# Altium schematic sheet 02_Filtr2.SchDoc
size A4; Organization: OLTEST; Revision: 01; SheetNumber: 2; SheetTotal: 2; Название листа: Название листа; Разработчик: Бондарчук С.; Прибор: R100; АМАК.000000.000 Э3: R100.220.020.000 Э3; Дата: 27.10.2018; Формат: A4; Rule: PcbType=ProtelPcb
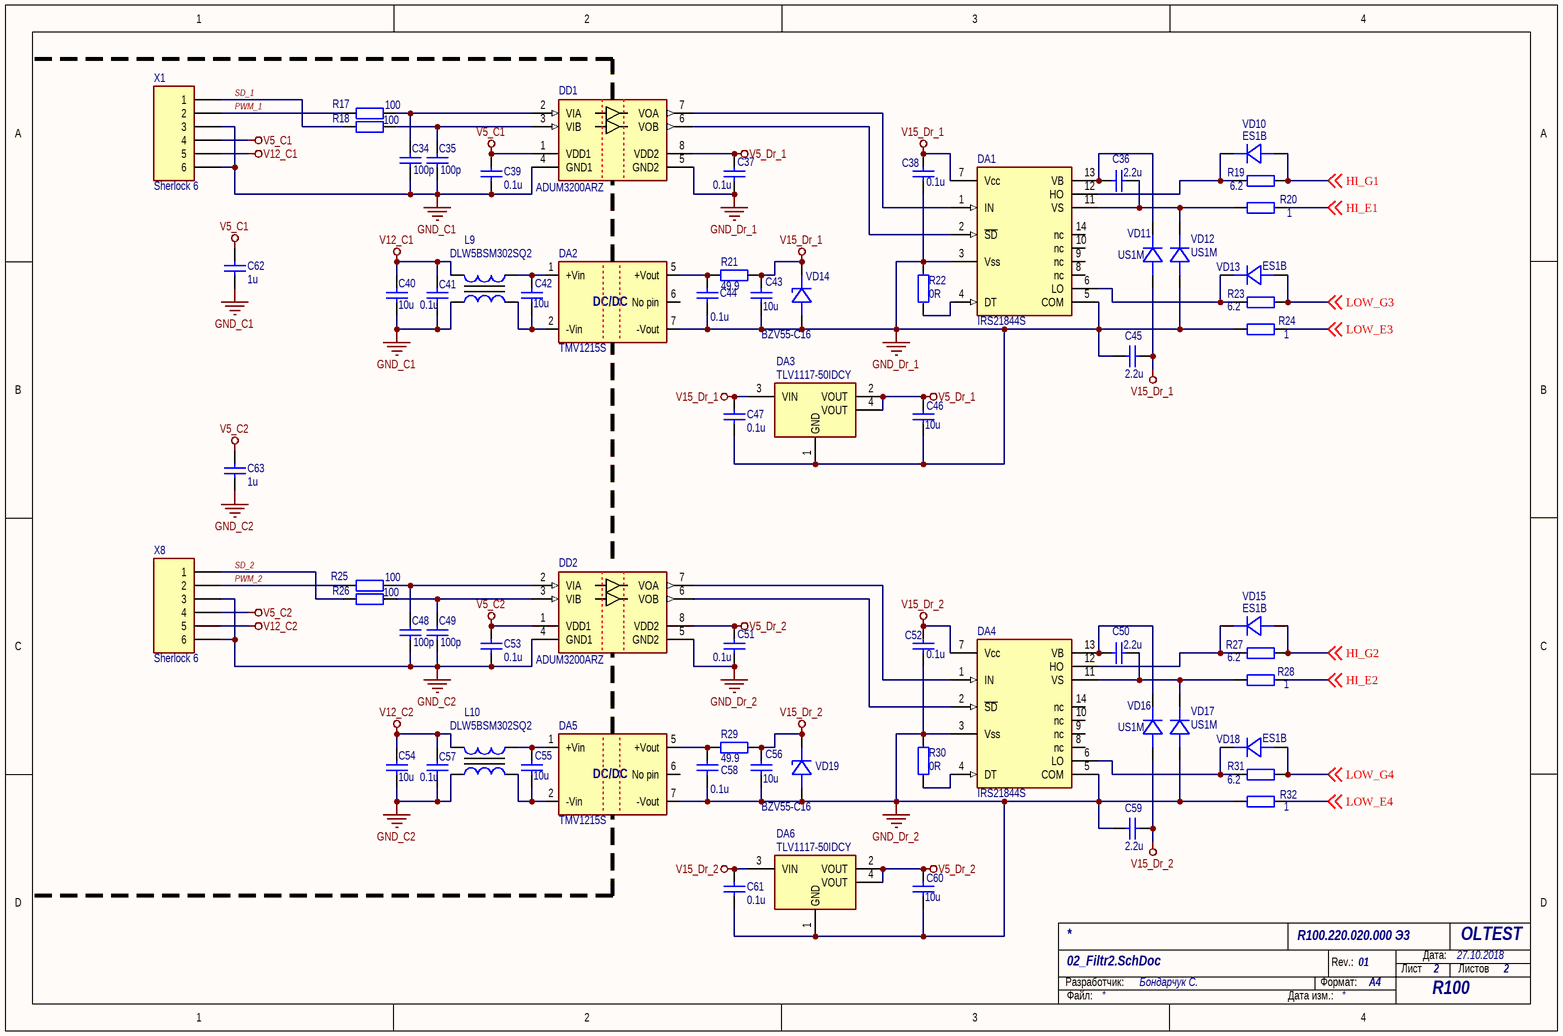
[diagram p0: 02_Filtr2.SchDoc]

## Parts
C34  100p  [SMD_C_0603]
C35  100p  [SMD_C_0603]
C36  2.2u  [SMD_C_1210]
C37  0.1u  [SMD_C_0603]
C38  0.1u  [SMD_C_0603]
C39  0.1u  [SMD_C_0603]
C40  10u  [SMD_C_1206]
C41  0.1u  [SMD_C_0603]
C42  10u  [SMD_C_1206]
C43  10u  [SMD_C_1206]
C44  0.1u  [SMD_C_0603]
C45  2.2u  [SMD_C_1210]
C46  10u  [SMD_C_1206]
C47  0.1u  [SMD_C_0603]
C48  100p  [SMD_C_0603]
C49  100p  [SMD_C_0603]
C50  2.2u  [SMD_C_1210]
C51  0.1u  [SMD_C_0603]
C52  0.1u  [SMD_C_0603]
C53  0.1u  [SMD_C_0603]
C54  10u  [SMD_C_1206]
C55  10u  [SMD_C_1206]
C56  10u  [SMD_C_1206]
C57  0.1u  [SMD_C_0603]
C58  0.1u  [SMD_C_0603]
C59  2.2u  [SMD_C_1210]
C60  10u  [SMD_C_1206]
C61  0.1u  [SMD_C_0603]
C62  1u  [SMD_C_0603]
C63  1u  [SMD_C_0603]
DA1  IRS21844S  [SOIC-14(127P600X175)]
DA2  TMV1215S  [SIP7]
DA3  TLV1117-50IDCY  [SOT-223_M]
DA4  IRS21844S  [SOIC-14(127P600X175)]
DA5  TMV1215S  [SIP7]
DA6  TLV1117-50IDCY  [SOT-223_M]
DD1  ADUM3200ARZ  [SOIC-8]
DD2  ADUM3200ARZ  [SOIC-8]
L9  DLW5BSM302SQ2  [DLW5BS(AH)]
L10  DLW5BSM302SQ2  [DLW5BS(AH)]
R17  100  [SMD_R_0603]
R18  100  [SMD_R_0603]
R19  6.2  [SMD_R_1206]
R20  1  [SMD_R_1206]
R21  49.9  [SMD_R_0805]
R22  0R  [SMD_R_0603]
R23  6.2  [SMD_R_1206]
R24  1  [SMD_R_1206]
R25  100  [SMD_R_0603]
R26  100  [SMD_R_0603]
R27  6.2  [SMD_R_1206]
R28  1  [SMD_R_1206]
R29  49.9  [SMD_R_0805]
R30  0R  [SMD_R_0603]
R31  6.2  [SMD_R_1206]
R32  1  [SMD_R_1206]
VD10  ES1B  [DO-214AC]
VD11  US1M  [DO-214AC]
VD12  US1M  [DO-214AC]
VD13  ES1B  [DO-214AC]
VD14  BZV55-C16  [SOD80C]
VD15  ES1B  [DO-214AC]
VD16  US1M  [DO-214AC]
VD17  US1M  [DO-214AC]
VD18  ES1B  [DO-214AC]
VD19  BZV55-C16  [SOD80C]
X1  Sherlock 6  [35362-0650]
X8  Sherlock 6  [35362-0650]

## Nets
GND_C1: C34.2 C35.2 C39.1 C40.1 C41.1 C62.2 DD1.4(GND1) L9.4 X1.3 X1.6
GND_C2: C48.2 C49.2 C53.1 C54.1 C57.1 C63.2 DD2.4(GND1) L10.4 X8.3 X8.6
GND_Dr_1: C37.1 C38.2 C43.1 C44.1 C45.2 C46.1 C47.1 DA1.3(Vss) DA1.5(COM) DA2.7(-Vout) DA3.1(GND) DD1.5(GND2) R22.1 R24.1 VD12.1(ANODE) VD14.1(ANODE)
GND_Dr_2: C51.1 C52.2 C56.1 C58.1 C59.2 C60.1 C61.1 DA4.3(Vss) DA4.5(COM) DA5.7(-Vout) DA6.1(GND) DD2.5(GND2) R30.1 R32.1 VD17.1(ANODE) VD19.1(ANODE)
V5_C1: C39.2 C62.1 DD1.1(VDD1) X1.4
V5_C2: C53.2 C63.1 DD2.1(VDD1) X8.4
V5_Dr_1: C37.2 C46.2 DA3.2(VOUT) DA3.4(VOUT) DD1.8(VDD2)
V5_Dr_2: C51.2 C60.2 DA6.2(VOUT) DA6.4(VOUT) DD2.8(VDD2)
V12_C1: C40.2 C41.2 L9.1 X1.5
V12_C2: C54.2 C57.2 L10.1 X8.5
V15_Dr_1: C38.1 C43.2 C45.1 C47.2 DA1.7(Vcc) DA3.3(VIN) R21.2 VD11.1(ANODE) VD14.2(CATHODE)
V15_Dr_2: C52.1 C56.2 C59.1 C61.2 DA4.7(Vcc) DA6.3(VIN) R29.2 VD16.1(ANODE) VD19.2(CATHODE)
HI_E1: R20.2 ; off-sheet HI_E1
HI_E2: R28.2 ; off-sheet HI_E2
HI_G1: R19.2 VD10.1(ANODE) ; off-sheet HI_G1
HI_G2: R27.2 VD15.1(ANODE) ; off-sheet HI_G2
LOW_E3: R24.2 ; off-sheet LOW_E3
LOW_E4: R32.2 ; off-sheet LOW_E4
LOW_G3: R23.2 VD13.1(ANODE) ; off-sheet LOW_G3
LOW_G4: R31.2 VD18.1(ANODE) ; off-sheet LOW_G4
PWM_1: R17.1 X1.2
PWM_2: R25.1 X8.2
SD_1: R18.1 X1.1
SD_2: R26.1 X8.1
NetC34_1: C34.1 DD1.2(VIA) R17.2
NetC35_1: C35.1 DD1.3(VIB) R18.2
NetC36_1: C36.1 DA1.13(VB) VD11.2(CATHODE)
NetC36_2: C36.2 DA1.11(VS) R20.1 VD12.2(CATHODE)
NetC42_1: C42.1 DA2.2(-Vin) L9.3
NetC42_2: C42.2 DA2.1(+Vin) L9.2
NetC44_2: C44.2 DA2.5(+Vout) R21.1
NetC48_1: C48.1 DD2.2(VIA) R25.2
NetC49_1: C49.1 DD2.3(VIB) R26.2
NetC50_1: C50.1 DA4.13(VB) VD16.2(CATHODE)
NetC50_2: C50.2 DA4.11(VS) R28.1 VD17.2(CATHODE)
NetC55_1: C55.1 DA5.2(-Vin) L10.3
NetC55_2: C55.2 DA5.1(+Vin) L10.2
NetC58_2: C58.2 DA5.5(+Vout) R29.1
NetDA1_1: DA1.1(IN) DD1.7(VOA)
NetDA1_2: DA1.2(~{SD}) DD1.6(VOB)
NetDA1_4: DA1.4(DT) R22.2
NetDA1_6: DA1.6(LO) R23.1 VD13.2(CATHODE)
NetDA1_12: DA1.12(HO) R19.1 VD10.2(CATHODE)
NetDA4_1: DA4.1(IN) DD2.7(VOA)
NetDA4_2: DA4.2(~{SD}) DD2.6(VOB)
NetDA4_4: DA4.4(DT) R30.2
NetDA4_6: DA4.6(LO) R31.1 VD18.2(CATHODE)
NetDA4_12: DA4.12(HO) R27.1 VD15.2(CATHODE)

Not connected (* = marked no-connect by the designer): DA1 8(nc) 9(nc) 10(nc) 14(nc); DA2 6(No_pin); DA4 8(nc) 9(nc) 10(nc) 14(nc); DA5 6(No_pin)

## Notes on the sheet
- Разработчик:
- Формат:
- Rev.:
- Лист
- Дата:
- Листов
- Файл:
- Дата изм.:

## Library data of the parts
C34 C35 C48 C49 = C0603 100p 100V 5%: SMD C 0603 MURATA 100V 5% NP0; PartNumber: GRM1885C2A101JA01; Manufacturer: MURATA; Value: 100p
C36 C45 C50 C59 = C1210 2.2u 100V 10%: SMD C 1210 MURATA 100V 10% X7R; PartNumber: GRM32ER72A225KA35L; Manufacturer: MURATA; Value: 2.2u
C37-C39 C41 C44 C47 C51-C53 C57 C58 C61 = C0603 0.1u 50V 10%: SMD C 0603 MURATA 50V 10% X7R; PartNumber: GRM188R71H104K; Manufacturer: MURATA; Value: 0.1u
C40 C42 C43 C46 C54-C56 C60 = C1206 10u 25V 20%: SMD C 1206 MURATA 25V 20% X5R; PartNumber: GRM31MR61E106M; Manufacturer: MURATA; Value: 10u
C62 C63 = C0603 1uF 25V 10%: SMD C 0603 MURATA 25V 10% X7R; PartNumber: GRM188R71E105KA12; Manufacturer: MURATA; Value: 1u
DA1 DA4 = IRS21844S: Half-Bridge Driver; Manufacturer: International Rectifier; PartNumber: IRS21844SPBF
DA2 DA5 = TMV1215S: DC/DC; Manufacturer: TRACO POWER; PartNumber: TMV1215S
DA3 DA6 = TLV1117-50IDCY: Voltage regulator 5.0V 800mA; Manufacturer: Texas Instrument; PartNumber: TLV1117-50IDCY
DD1 DD2 = ADUM3200ARZ: Dual Channel Digital Isolator, Enhanced System-Level ESD Reliability, 2.5 KV rms Insulation Rating, 1 Mbps Data Rate, 150 ns Delay, Industrial, 8-pin SOIC (R-8), Tube; Manufacturer: Analog Devices; PartNumber: ADUM3200ARZ
L9 L10 = DLW5BSM302SQ2: SMD Common Mode Choke Coil 0.5A Z = 3000 Ohm / 100 MHz; Manufacturer: MURATA; PartNumber: DLW5BSM302SQ2
R17 R18 R25 R26 = R0603 100 1%: SMD R 0603 VISHAY 0.1W 75V 1% 100ppm; PartNumber: CRCW0603100RFK; Manufacturer: VISHAY; Value: 100
R19 R23 R27 R31 = R1206 6.2 1%: SMD R 1206 VISHAY 0.25W 200V 1% 100ppm; PartNumber: CRCW12066R20FK; Manufacturer: VISHAY; Value: 6.2
R20 R24 R28 R32 = R1206 1 1%: SMD R 1206 VISHAY 0.25W 200V 1% 100ppm; PartNumber: CRCW12061R00FK; Manufacturer: VISHAY; Value: 1
R21 R29 = R0805 49.9 1%: SMD R 0805 VISHAY 0.125W 150V 1% 100ppm; PartNumber: CRCW080549R9FK; Manufacturer: VISHAY; Value: 49.9
R22 R30 = R0603 0R 1%: SMD R 0603 VISHAY 0.1W 75V 1% 100ppm; PartNumber: CRCW06030000Z0; Manufacturer: VISHAY; Value: 0R
VD10 VD13 VD15 VD18 = ES1B: Vr=100V If=1A Ultrafast; Manufacturer: Vishay; PartNumber: ES1B
VD11 VD12 VD16 VD17 = US1M: Vr=1000V If=1A Ultrafast; Manufacturer: Vishay; PartNumber: US1M
VD14 VD19 = BZV55-C16: 0.5W Vz=16V +-5%; Manufacturer: NXP; PartNumber: BZV55-C16
X1 X8 = 35363-0650: Sherlock 6 Side, 2A 125V 2mm; Manufacturer: MOLEX; PartNumber: 35362-0650